# EasyEDA schematic SCH_Alexey_Beekeeper_2023-01-21.json
TITLE: Sheet_1; REV: 1.0; Date: 2023-01-17; Sheet: 1/1; Company: Your Company
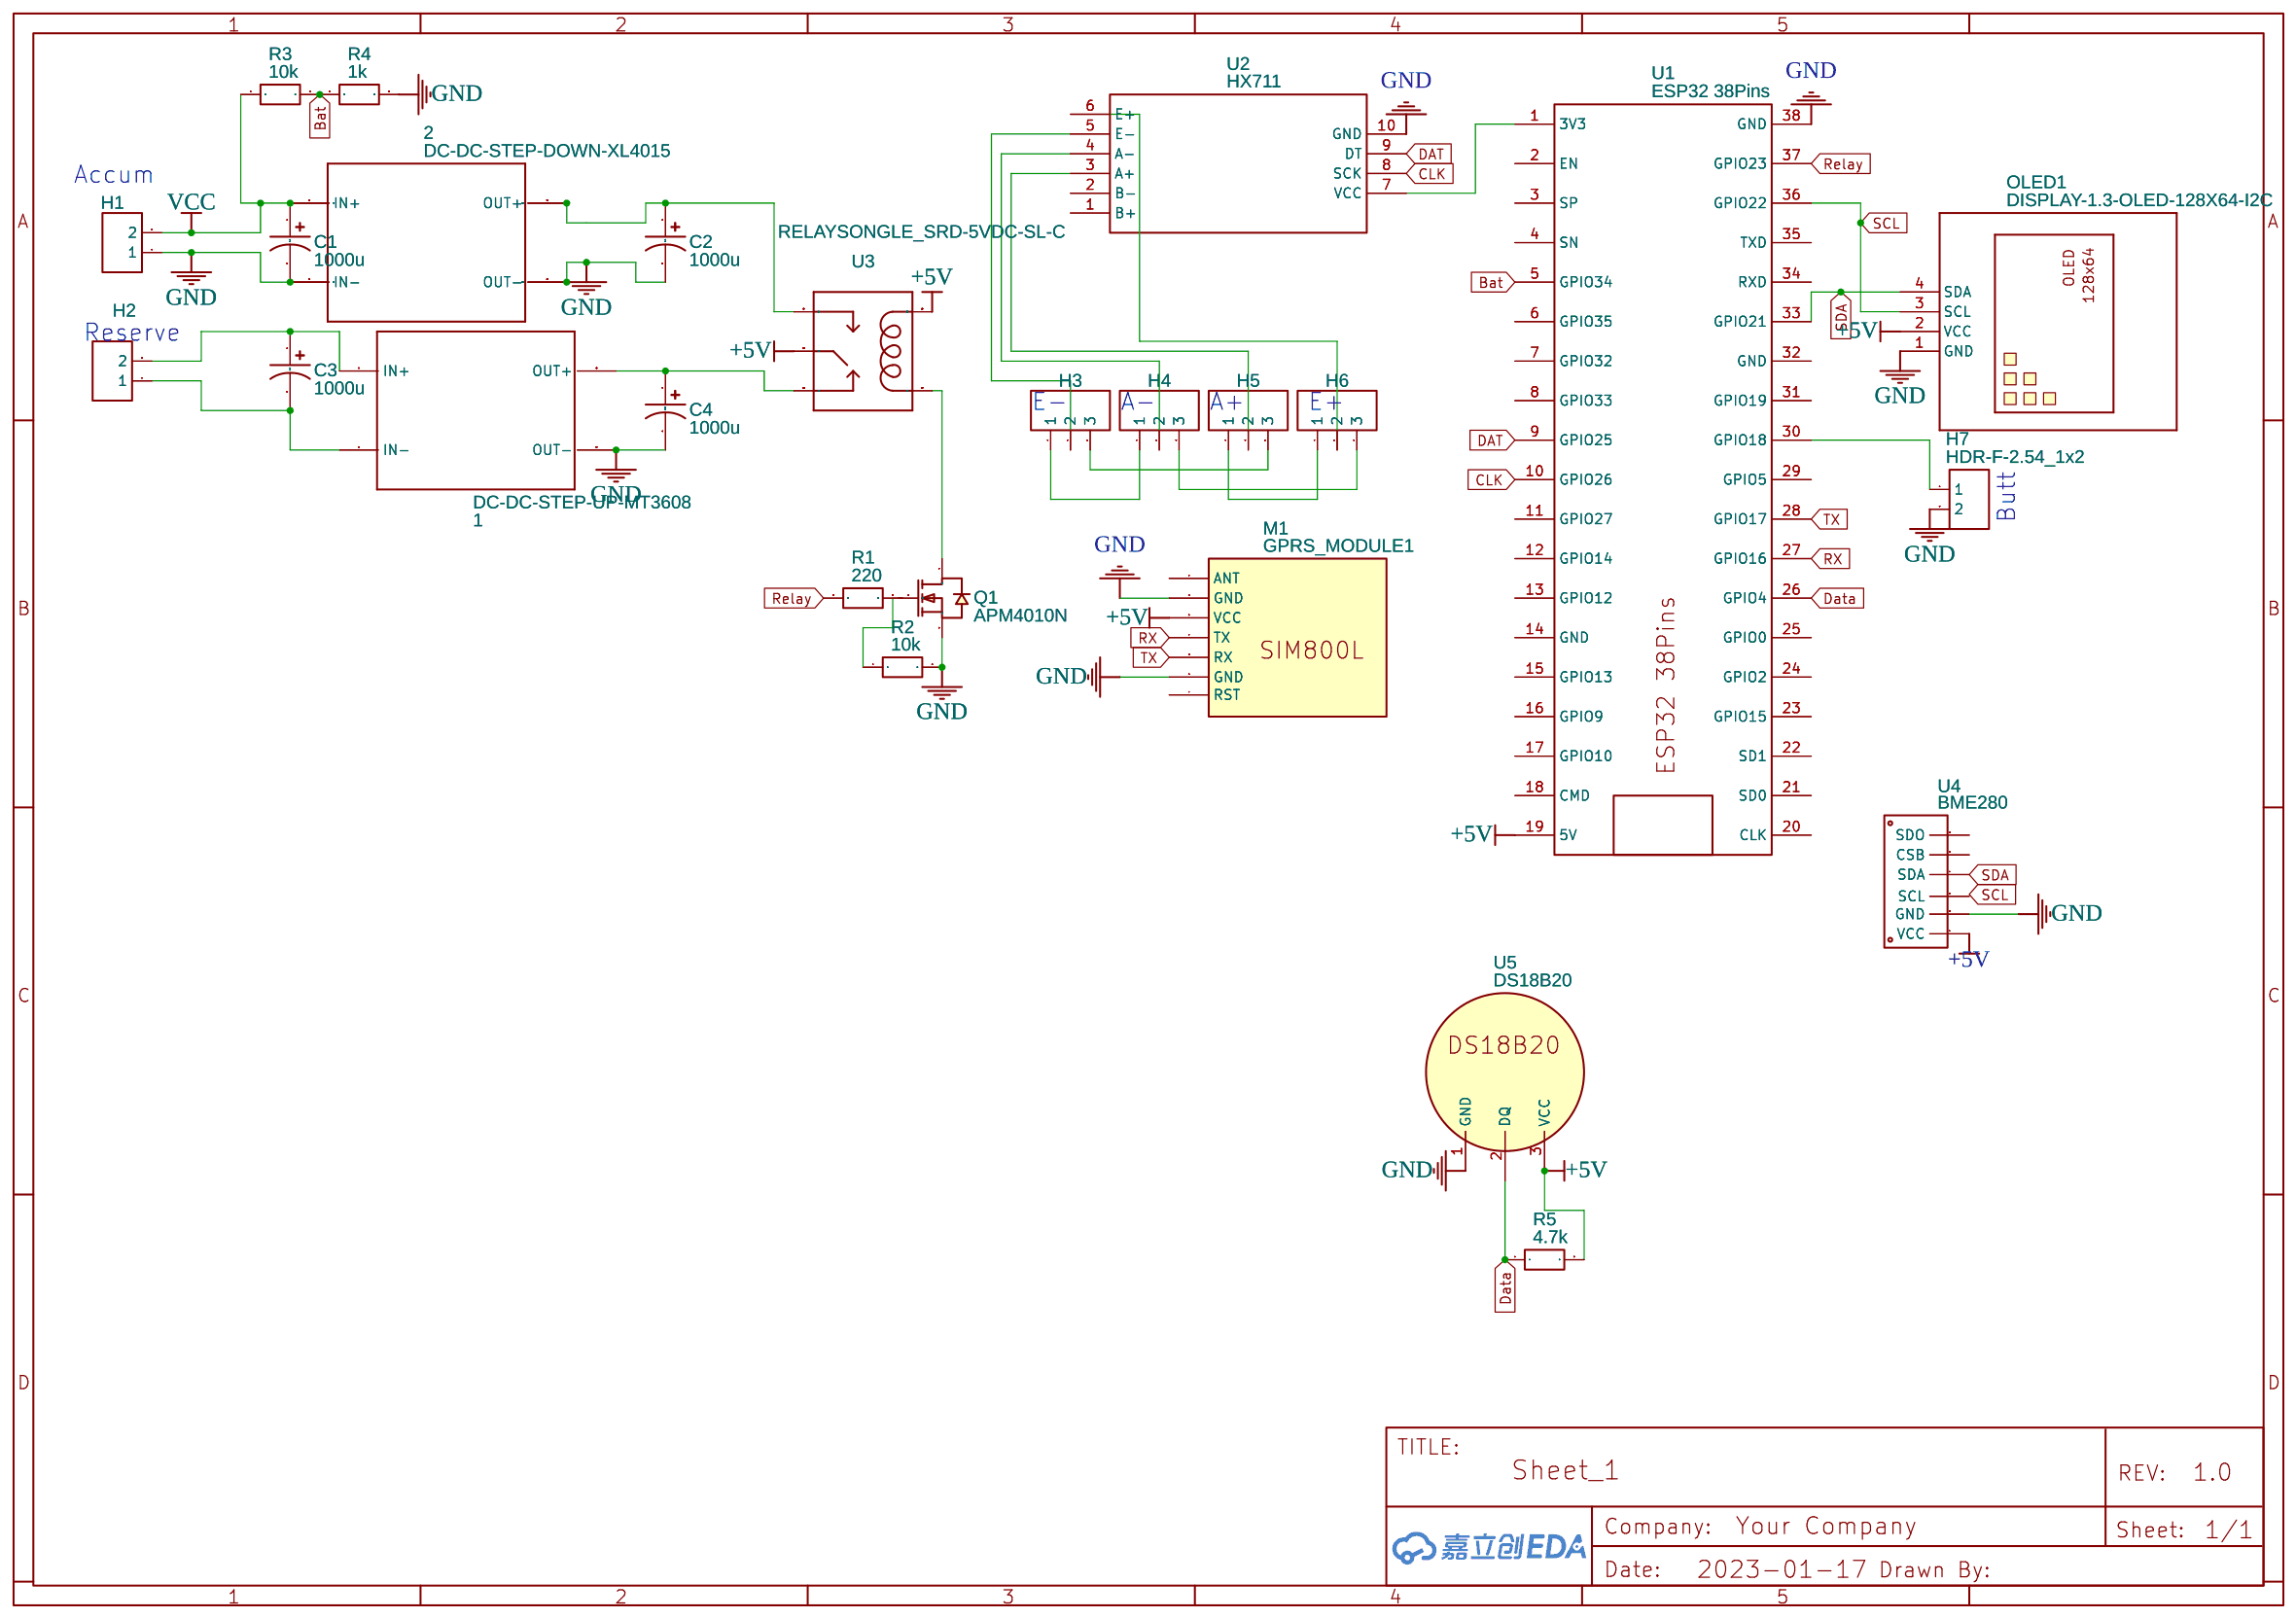
[diagram p0: schematic sheet]

## Parts
1  DC-DC-STEP-UP-MT3608  [DC-DC-STEP-UP-MT3608]
2  DC-DC-STEP-DOWN-XL4015  [DC-DC-STEP-DOWN-XL4015]
C1  1000u  [CAP-D12.5×F5.0]
C2  1000u  [CAP-D12.5×F5.0]
C3  1000u  [CAP-D12.5×F5.0]
C4  1000u  [CAP-D12.5×F5.0]
H1  HDR-F-2.54_1x2  [HDR-F-2.54_1X2]
H2  HDR-F-2.54_1x2  [HDR-F-2.54_1X2]
H3  HDR-F-2.54_1x3  [HDR-F-2.54_1X3]
H4  HDR-F-2.54_1x3  [HDR-F-2.54_1X3]
H5  HDR-F-2.54_1x3  [HDR-F-2.54_1X3]
H6  HDR-F-2.54_1x3  [HDR-F-2.54_1X3]
H7  HDR-F-2.54_1x2  [HDR-F-2.54_1X2]
M1  GPRS_MODULE1  [SIM800L_MODULE]
OLED1  DISPLAY-1.3-OLED-128X64-I2C  [1.3 I2C OLED SSD1306]
Q1  APM4010N  [TO-252-2_L6.6-W6.1-P4.57-LS9.9-BR-CW]
R1  220  [R0603]
R2  10k  [R1206]
R3  10k  [R1206]
R4  1k  [R1206]
R5  4.7k  [R1206]
U1  ESP32 38Pins  [ESP32 38PINS]
U2  HX711  [HX711-MODULE]
U3  RELAYSONGLE_SRD-5VDC-SL-C  [SRD-5VDC-SL-C]
U4  BME280  [BME280]
U5  DS18B20  [DS18B20]

## Library data of the parts
1 = DC-DC-STEP-UP-MT3608: Contributor: arenda1234
2 = DC-DC-STEP-DOWN-XL4015: Contributor: Oleg Krava
C1-C4 = CE_TH_D12.5×F5.0_US: Contributor: LCEDA_Lib
H1 H2 H7 = HDR-F-2.54_1x2: Supplier Part: C49661; Supplier: LCSC; Contributor: LCEDA_Lib
H3-H6 = HDR-F-2.54_1x3: Supplier Part: C146690; Supplier: LCSC; Contributor: LCEDA_Lib
M1 = GPRS_MODULE1: Supplier Part: SIM800L EVB; Manufacturer: SIMCOM; Manufacturer Part: SIM800L; Contributor: ManiDeepReddyDPSNDGL
OLED1 = DISPLAY-1.3-OLED-128X64-I2C: Contributor: hdutton
Q1 = APM4010N: Supplier: LCSC; Supplier Part: C724986; Manufacturer: VBsemi Elec; Manufacturer Part: APM4010NUC; Contributor: LCSC; JLCPCB Part Class: Extended Part
R1 = R_0603_EU: Contributor: LCEDA_Lib
R2-R5 = R_1206_EU: Contributor: LCEDA_Lib
U1 = ESP32 38Pins: Contributor: Amd Cool
U2 = HX711: Contributor: Shreyansh_D
U3 = RELAYSONGLE_SRD-5VDC-SL-C: SPDT relay (COM-00101); sourceId: 0mfxP71jB
U4 = BME280: Contributor: marius4
U5 = DS18B20: Manufacturer: 1keellit1; Supplier: 1keellit1; Contributor: 1keellit1

## Nets
+5V: M1.3(VCC) OLED1.2(VCC) R5.2 U1.19(5V) U3.COIL2 U3.COMMON(MAIN) U4.1(VCC) U5.3(VCC)
GND: 1.OUT- 2.I-(IN-) 2.IN- 2.O-(OUT-) 2.OUT- C1.2 C2.2 C4.2 H1.1 H7.2 M1.2(GND) M1.6(GND) OLED1.1(GND) Q1.3(S) R2.2 R4.2 U1.38(GND) U2.10(GND) U4.2(GND) U5.1(GND)
VCC: 2.I+(IN+) 2.IN+ C1.1 H1.2 R3.1
Bat: R3.2 R4.1 U1.5(GPIO34)
CLK: U1.10(GPIO26) U2.8(SCK)
DAT: U1.9(GPIO25) U2.9(DT)
Data: R5.1 U1.26(GPIO4) U5.2(DQ)
Relay: R1.1 U1.37(GPIO23)
RX: M1.4(TX) U1.27(GPIO16)
SCL: OLED1.3(SCL) U1.36(GPIO22)
SDA: OLED1.4(SDA) U1.33(GPIO21) U4.4(SDA)
TX: M1.5(RX) U1.28(GPIO17)
Net-(1-IN+): 1.IN+ C3.1 H2.2
Net-(1-IN-): 1.IN- C3.2 H2.1
Net-(1-OUT+): 1.OUT+ C4.1 U3.CLOSED(NC)
Net-(2-O+): 2.O+(OUT+) 2.OUT+ C2.1 U3.OPEN(NO)
Net-(H3-1): H3.1 H4.1
Net-(H3-2): H3.2 U2.5(E-)
Net-(H3-3): H3.3 H5.3
Net-(H4-2): H4.2 U2.4(A-)
Net-(H4-3): H4.3 H6.3
Net-(H5-1): H5.1 H6.1
Net-(H5-2): H5.2 U2.3(A+)
Net-(H6-2): H6.2 U2.6(E+)
Net-(H7-1): H7.1 U1.30(GPIO18)
Net-(Q1-1): Q1.1(G) R2.1
Net-(Q1-2): Q1.2(D) U3.COIL1
Net-(U1-1): U1.1(3V3) U2.7(VCC)

Not connected (* = marked no-connect by the designer): M1 1(ANT) 7(RST); R1 2; U1 2(EN) 3(SP) 4(SN) 6(GPIO35) 7(GPIO32) 8(GPIO33) 11(GPIO27) 12(GPIO14) 13(GPIO12) 14(GND) 15(GPIO13) 16(GPIO9) 17(GPIO10) 18(CMD) 20(CLK) 21(SD0) 22(SD1) 23(GPIO15) 24(GPIO2) 25(GPIO0) 29(GPIO5) 31(GPIO19) 32(GND) 34(RXD) 35(TXD); U2 1(B+) 2(B-); U4 3(SCL) 5(CSB) 6(SDO)

## Notes on the sheet
- Accum
- Reserve
- E-
- A-
- A+
- E+
- Butt
